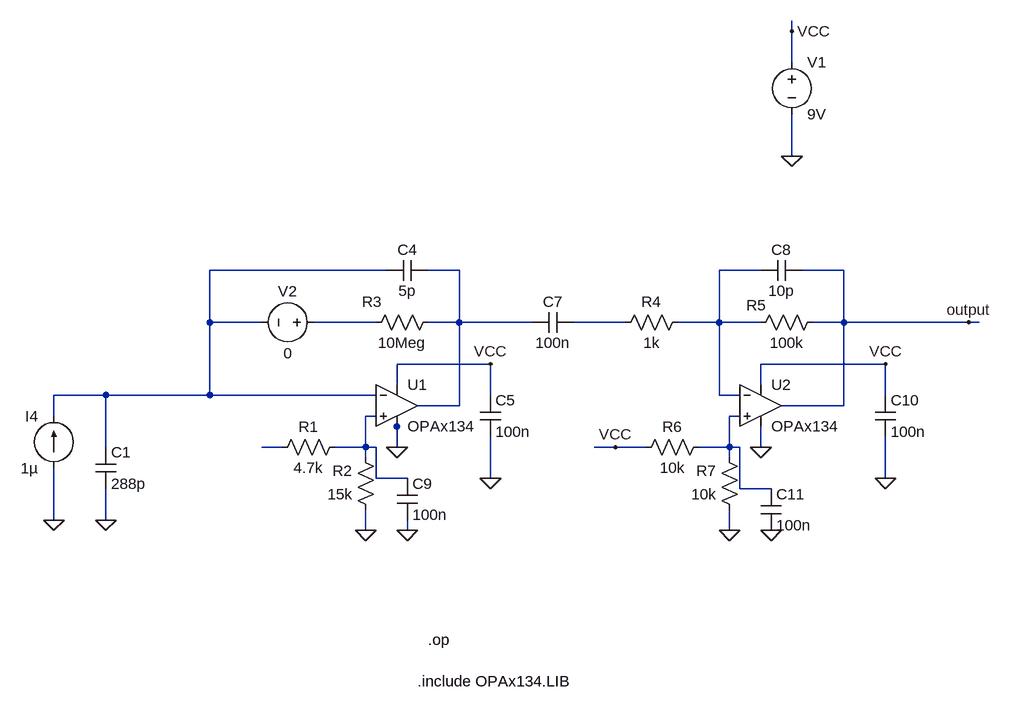
[diagram p0: schematic sim.asc]
sim.asc, the LTspice schematic file:
Version 4
SHEET 1 1224 680
WIRE 896 -576 896 -592
WIRE 896 -528 896 -576
WIRE 896 -384 896 -448
WIRE 272 -208 0 -208
WIRE 384 -208 336 -208
WIRE 848 -208 784 -208
WIRE 976 -208 912 -208
WIRE 0 -128 0 -208
WIRE 80 -128 0 -128
WIRE 256 -128 160 -128
WIRE 384 -128 384 -208
WIRE 384 -128 336 -128
WIRE 496 -128 384 -128
WIRE 640 -128 560 -128
WIRE 784 -128 784 -208
WIRE 784 -128 720 -128
WIRE 848 -128 784 -128
WIRE 976 -128 976 -208
WIRE 976 -128 928 -128
WIRE 1168 -128 976 -128
WIRE 1184 -128 1168 -128
WIRE 432 -64 288 -64
WIRE 1040 -64 848 -64
WIRE 288 -32 288 -64
WIRE 848 -32 848 -64
WIRE -160 -16 -240 -16
WIRE 0 -16 0 -128
WIRE 0 -16 -160 -16
WIRE 256 -16 0 -16
WIRE 432 -16 432 -64
WIRE 784 -16 784 -128
WIRE 816 -16 784 -16
WIRE 1040 -16 1040 -64
WIRE 384 0 384 -128
WIRE 384 0 320 0
WIRE 976 0 976 -128
WIRE 976 0 880 0
WIRE -240 16 -240 -16
WIRE 256 16 240 16
WIRE 816 16 800 16
WIRE 288 32 288 16
WIRE -160 64 -160 -16
WIRE 112 64 80 64
WIRE 240 64 240 16
WIRE 240 64 192 64
WIRE 256 64 240 64
WIRE 288 64 288 32
WIRE 624 64 592 64
WIRE 672 64 624 64
WIRE 800 64 800 16
WIRE 800 64 752 64
WIRE 816 64 800 64
WIRE 848 64 848 32
WIRE 240 80 240 64
WIRE 800 80 800 64
WIRE 256 112 256 64
WIRE 304 112 256 112
WIRE 432 112 432 48
WIRE 1040 112 1040 48
WIRE 816 128 816 64
WIRE 864 128 816 128
WIRE -240 176 -240 96
WIRE -160 176 -160 128
WIRE 240 192 240 160
WIRE 304 192 304 176
WIRE 800 192 800 160
FLAG 896 -384 0
FLAG 896 -576 VCC
FLAG 240 192 0
FLAG 288 64 0
FLAG 432 -64 VCC
FLAG 432 112 0
FLAG 624 64 VCC
FLAG 800 192 0
FLAG 848 64 0
FLAG 1168 -128 output
FLAG 1040 112 0
FLAG 1040 -64 VCC
FLAG 304 192 0
FLAG 864 192 0
FLAG -160 176 0
FLAG -240 176 0
DATAFLAG 0 -128 "$-V(N002)"
SYMBOL OpAmps\\opamp2 288 -64 R0
SYMATTR InstName U1
SYMATTR Value OPAx134
SYMBOL OpAmps\\opamp2 848 -64 R0
SYMATTR InstName U2
SYMATTR Value OPAx134
SYMBOL voltage 896 -544 R0
WINDOW 123 0 0 Left 0
WINDOW 39 0 0 Left 0
SYMATTR InstName V1
SYMATTR Value 9V
SYMBOL res 208 48 R90
WINDOW 0 0 56 VBottom 2
WINDOW 3 32 56 VTop 2
SYMATTR InstName R1
SYMATTR Value 4.7k
SYMBOL res 256 176 R180
WINDOW 0 36 76 Left 2
WINDOW 3 36 40 Left 2
SYMATTR InstName R2
SYMATTR Value 15k
SYMBOL res 352 -144 R90
WINDOW 0 0 102 VBottom 2
WINDOW 3 32 56 VTop 2
SYMATTR InstName R3
SYMATTR Value 10Meg
SYMBOL cap 336 -224 R90
WINDOW 0 0 32 VBottom 2
WINDOW 3 32 32 VTop 2
SYMATTR InstName C4
SYMATTR Value 5p
SYMBOL current -240 96 R180
WINDOW 0 24 80 Left 2
WINDOW 3 24 0 Left 2
WINDOW 123 0 0 Left 0
WINDOW 39 0 0 Left 0
SYMATTR InstName I4
SYMATTR Value 1µ
SYMBOL cap 560 -144 R90
WINDOW 0 0 32 VBottom 2
WINDOW 3 32 32 VTop 2
SYMATTR InstName C7
SYMATTR Value 100n
SYMBOL res 736 -144 R90
WINDOW 0 0 56 VBottom 2
WINDOW 3 32 56 VTop 2
SYMATTR InstName R4
SYMATTR Value 1k
SYMBOL res 944 -144 R90
WINDOW 0 5 103 VBottom 2
WINDOW 3 32 56 VTop 2
SYMATTR InstName R5
SYMATTR Value 100k
SYMBOL cap 912 -224 R90
WINDOW 0 0 32 VBottom 2
WINDOW 3 32 32 VTop 2
SYMATTR InstName C8
SYMATTR Value 10p
SYMBOL res 768 48 R90
WINDOW 0 0 56 VBottom 2
WINDOW 3 32 56 VTop 2
SYMATTR InstName R6
SYMATTR Value 10k
SYMBOL res 816 176 R180
WINDOW 0 36 76 Left 2
WINDOW 3 36 40 Left 2
SYMATTR InstName R7
SYMATTR Value 10k
SYMBOL cap 288 112 R0
SYMATTR InstName C9
SYMATTR Value 100n
SYMBOL cap 848 128 R0
SYMATTR InstName C11
SYMATTR Value 100n
SYMBOL cap 1024 -16 R0
SYMATTR InstName C10
SYMATTR Value 100n
SYMBOL cap 416 -16 R0
SYMATTR InstName C5
SYMATTR Value 100n
SYMBOL voltage 176 -128 R90
WINDOW 0 -32 56 VBottom 2
WINDOW 3 32 56 VTop 2
WINDOW 123 0 0 Left 0
WINDOW 39 0 0 Left 0
SYMATTR InstName V2
SYMATTR Value 0
SYMBOL cap -176 64 R0
SYMATTR InstName C1
SYMATTR Value 288p
TEXT 320 424 Left 2 !.include OPAx134.LIB
TEXT 336 360 Left 2 !.op

The netlist it stands for:
* sim.asc
XU1 N006 N001 VCC 0 N002 OPAx134  ; pins In+ In- V+ V- OUT
XU2 N007 N003 VCC 0 output OPAx134  ; pins In+ In- V+ V- OUT
V1 VCC 0 9V
R1 N006 N008 4.7k
R2 0 N006 15k
R3 N002 N004 10Meg
C4 N002 N001 5p
I4 0 N001 1µ
C7 N005 N002 100n
R4 N003 N005 1k
R5 output N003 100k
C8 output N003 10p
R6 N007 VCC 10k
R7 0 N007 10k
C9 N006 0 100n
C11 N007 0 100n
C10 VCC 0 100n
C5 VCC 0 100n
V2 N004 N001 0
C1 N001 0 288p
.include OPAx134.LIB
.op
.backanno
.end